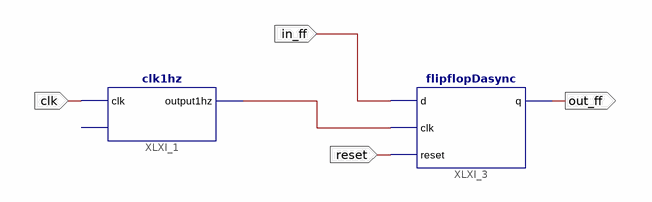
[diagram p0: schematic sheet 1]
// Xilinx ISE schematic top.sch (spartan3e) as structural Verilog: 2 symbols, 4 ports
module top (
  input  clk,
  input  in_ff,
  input  reset,
  output out_ff
);

  wire XLXN_2;

  clk1hz XLXI_1 (.clk(clk), .output1hz(XLXN_2));  // open: reset
  flipflopDasync XLXI_3 (.d(in_ff), .clk(XLXN_2), .reset(reset), .q(out_ff));
endmodule
